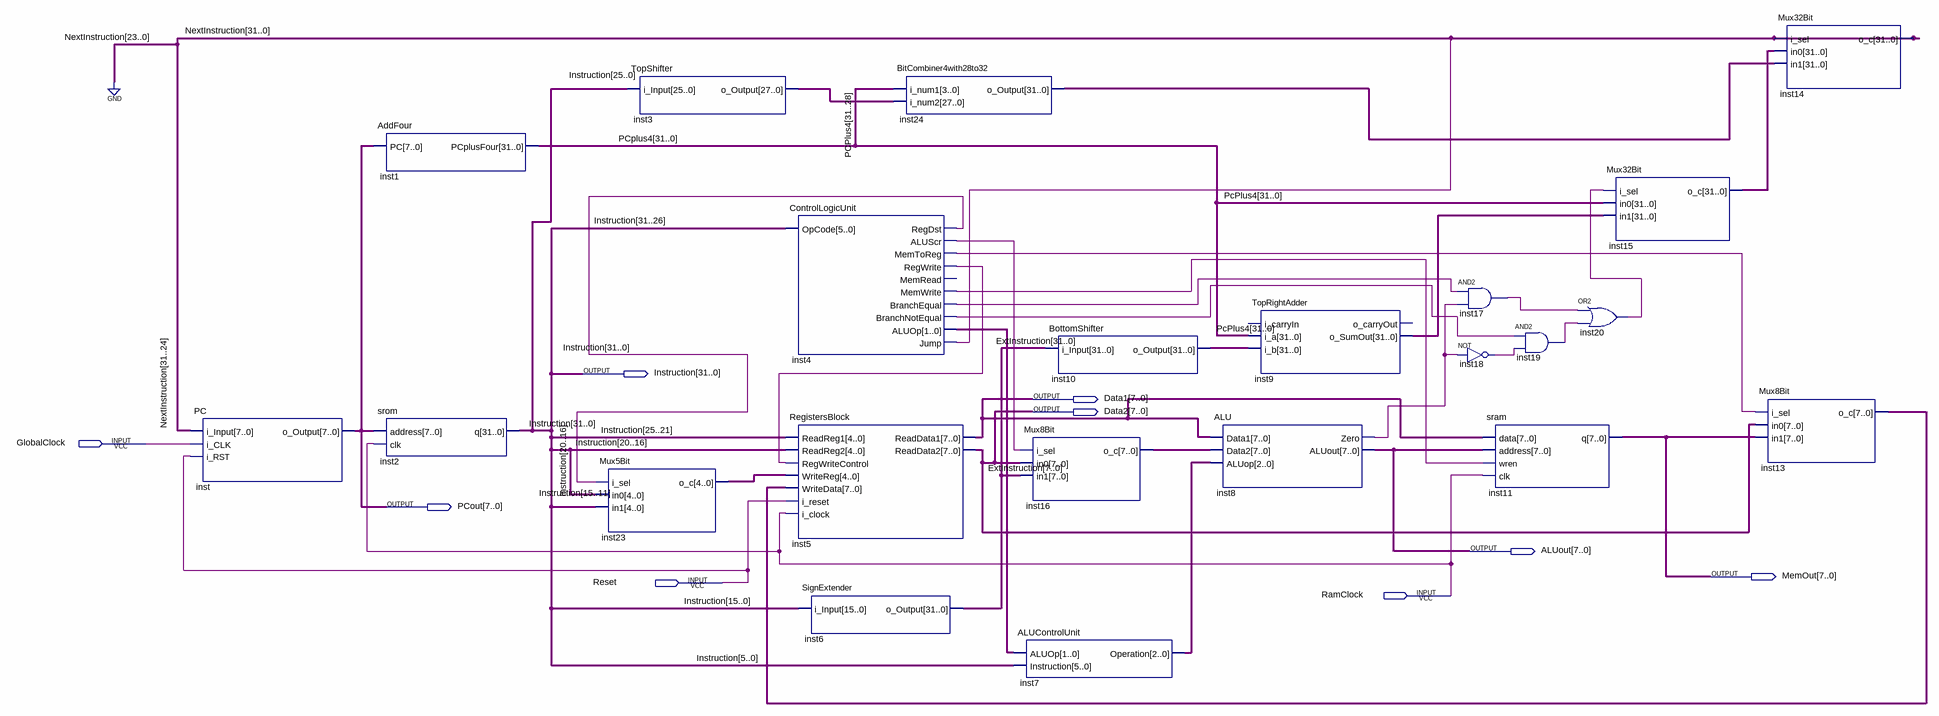
[diagram p0: schematic sheet]
// Quartus schematic SingleCycleProcessor.bdf as structural Verilog: 22 symbols, 9 pins
module SingleCycleProcessor (
  input  GlobalClock,
  input  Reset,
  input  RamClock,
  output [31:0] Instruction,
  output [7:0] Data1,
  output [7:0] Data2,
  output [7:0] PCout,
  output [7:0] ALUout,
  output [7:0] MemOut
);

  wire inst4_aluscr, inst4_branchequal, inst4_branchnotequal, inst4_jump, inst4_memtoreg, inst4_memwrite,
       inst4_regdst, inst4_regwrite, inst8_zero, inst17_out, inst18_out, inst19_out, inst20_out;
  wire [1:0] inst4_aluop;
  wire [2:0] inst7_operation;
  wire [4:0] inst23_o_c;
  wire [7:0] inst13_o_c, inst16_o_c;
  wire [27:0] inst3_o_output;
  wire [31:0] ExtInstruction, inst9_o_sumout, inst10_o_output, inst15_o_c, inst24_o_output, NextInstruction,
       PcPlus4;

  PC inst (.i_Input(NextInstruction[31:24]), .i_CLK(GlobalClock), .i_RST(Reset), .o_Output(PCout));
  AddFour inst1 (.PC(PCout), .PCplusFour(PcPlus4));
  srom inst2 (.address(PCout), .clk(RamClock), .q(Instruction));
  TopShifter inst3 (.i_Input(Instruction[25:0]), .o_Output(inst3_o_output));
  Mux5Bit inst23 (.i_sel(inst4_regdst), .in0(Instruction[20:16]), .in1(Instruction[15:11]), .o_c(inst23_o_c));
  ControlLogicUnit inst4 (
    .OpCode(Instruction[31:26]), .RegDst(inst4_regdst), .ALUScr(inst4_aluscr), .MemToReg(inst4_memtoreg),
    .RegWrite(inst4_regwrite), .MemWrite(inst4_memwrite), .BranchEqual(inst4_branchequal),
    .BranchNotEqual(inst4_branchnotequal), .ALUOp(inst4_aluop), .Jump(inst4_jump));  // open: MemRead
  RegistersBlock inst5 (
    .ReadReg1(Instruction[25:21]), .ReadReg2(Instruction[20:16]), .RegWriteControl(inst4_regwrite),
    .WriteReg(inst23_o_c), .WriteData(inst13_o_c), .i_reset(Reset), .i_clock(RamClock), .ReadData1(Data1),
    .ReadData2(Data2));
  SignExtender inst6 (.i_Input(Instruction[15:0]), .o_Output(ExtInstruction));
  BitCombiner4with28to32 inst24 (.i_num1(PcPlus4[31:28]), .i_num2(inst3_o_output), .o_Output(inst24_o_output));
  Mux8Bit inst16 (.i_sel(inst4_aluscr), .in0(Data2), .in1(ExtInstruction[7:0]), .o_c(inst16_o_c));
  ALUControlUnit inst7 (.ALUOp(inst4_aluop), .Instruction(Instruction[5:0]), .Operation(inst7_operation));
  BottomShifter inst10 (.i_Input(ExtInstruction), .o_Output(inst10_o_output));
  ALU inst8 (.Data1(Data1), .Data2(inst16_o_c), .ALUop(inst7_operation), .Zero(inst8_zero), .ALUout(ALUout));
  TopRightAdder inst9 (.i_a(PcPlus4), .i_b(inst10_o_output), .o_SumOut(inst9_o_sumout));  // open: i_carryIn, o_carryOut
  and inst17 (inst17_out, inst4_branchequal, inst8_zero);
  not inst18 (inst18_out, inst8_zero);
  sram inst11 (.data(Data1), .address(ALUout), .wren(inst4_memwrite), .clk(RamClock), .q(MemOut));
  and inst19 (inst19_out, inst4_branchnotequal, inst18_out);
  or inst20 (inst20_out, inst17_out, inst19_out);
  Mux32Bit inst15 (.i_sel(inst20_out), .in0(PcPlus4), .in1(inst9_o_sumout), .o_c(inst15_o_c));
  Mux32Bit inst14 (.i_sel(NextInstruction), .in0(inst15_o_c), .in1(inst24_o_output), .o_c(NextInstruction));
  Mux8Bit inst13 (.i_sel(inst4_memtoreg), .in0(Data2), .in1(MemOut), .o_c(inst13_o_c));
  // also tied to GND on the sheet: {NextInstruction[0], NextInstruction[1], NextInstruction[2], NextInstruction[3], NextInstruction[4], NextInstruction[5], NextInstruction[6], NextInstruction[7], NextInstruction[8], NextInstruction[9], NextInstruction[10], NextInstruction[11], NextInstruction[12], NextInstruction[13], NextInstruction[14], NextInstruction[15], NextInstruction[16], NextInstruction[17], NextInstruction[18], NextInstruction[19], NextInstruction[20], NextInstruction[21], NextInstruction[22], NextInstruction[23]}
endmodule
